# Altium project Temperature_sensor.PrjPcb
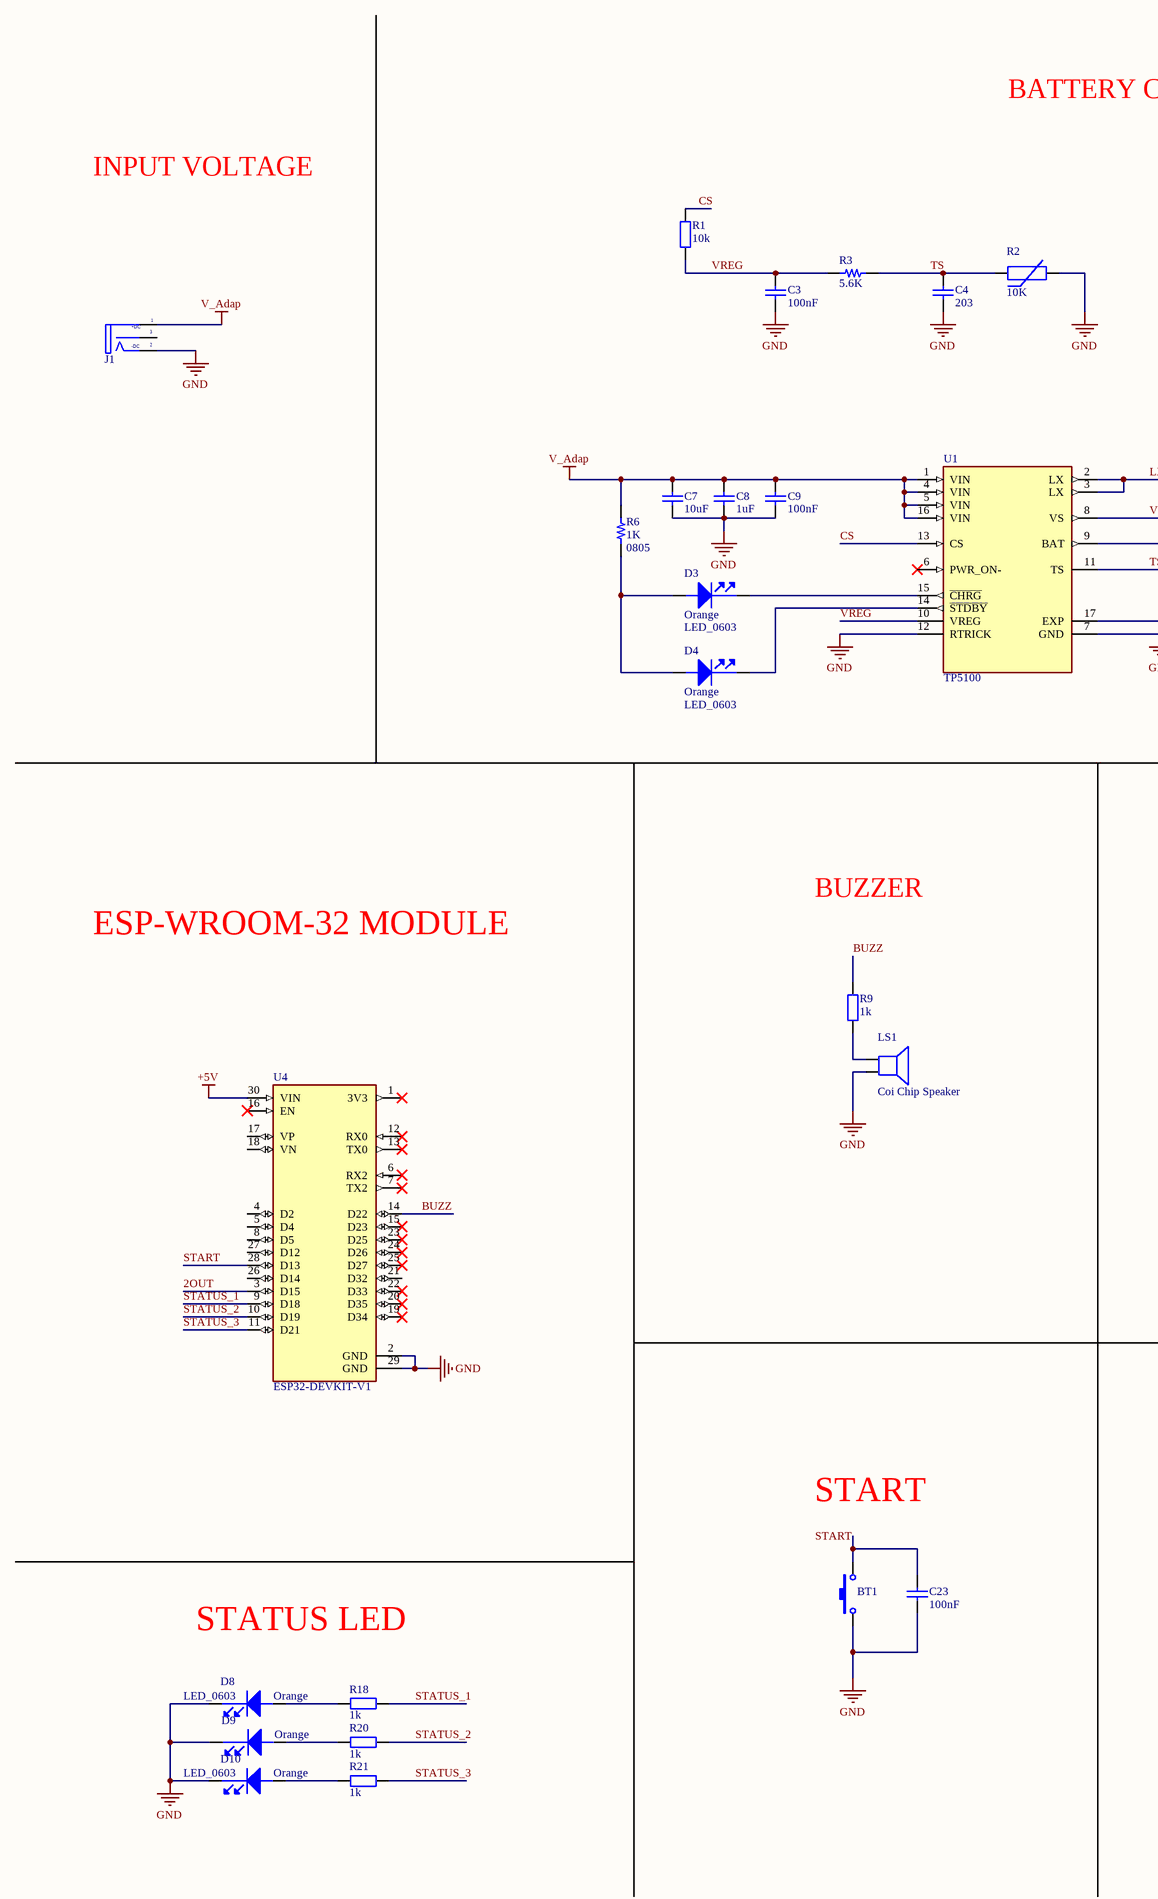
[diagram p0: Sheet1.SchDoc, left]
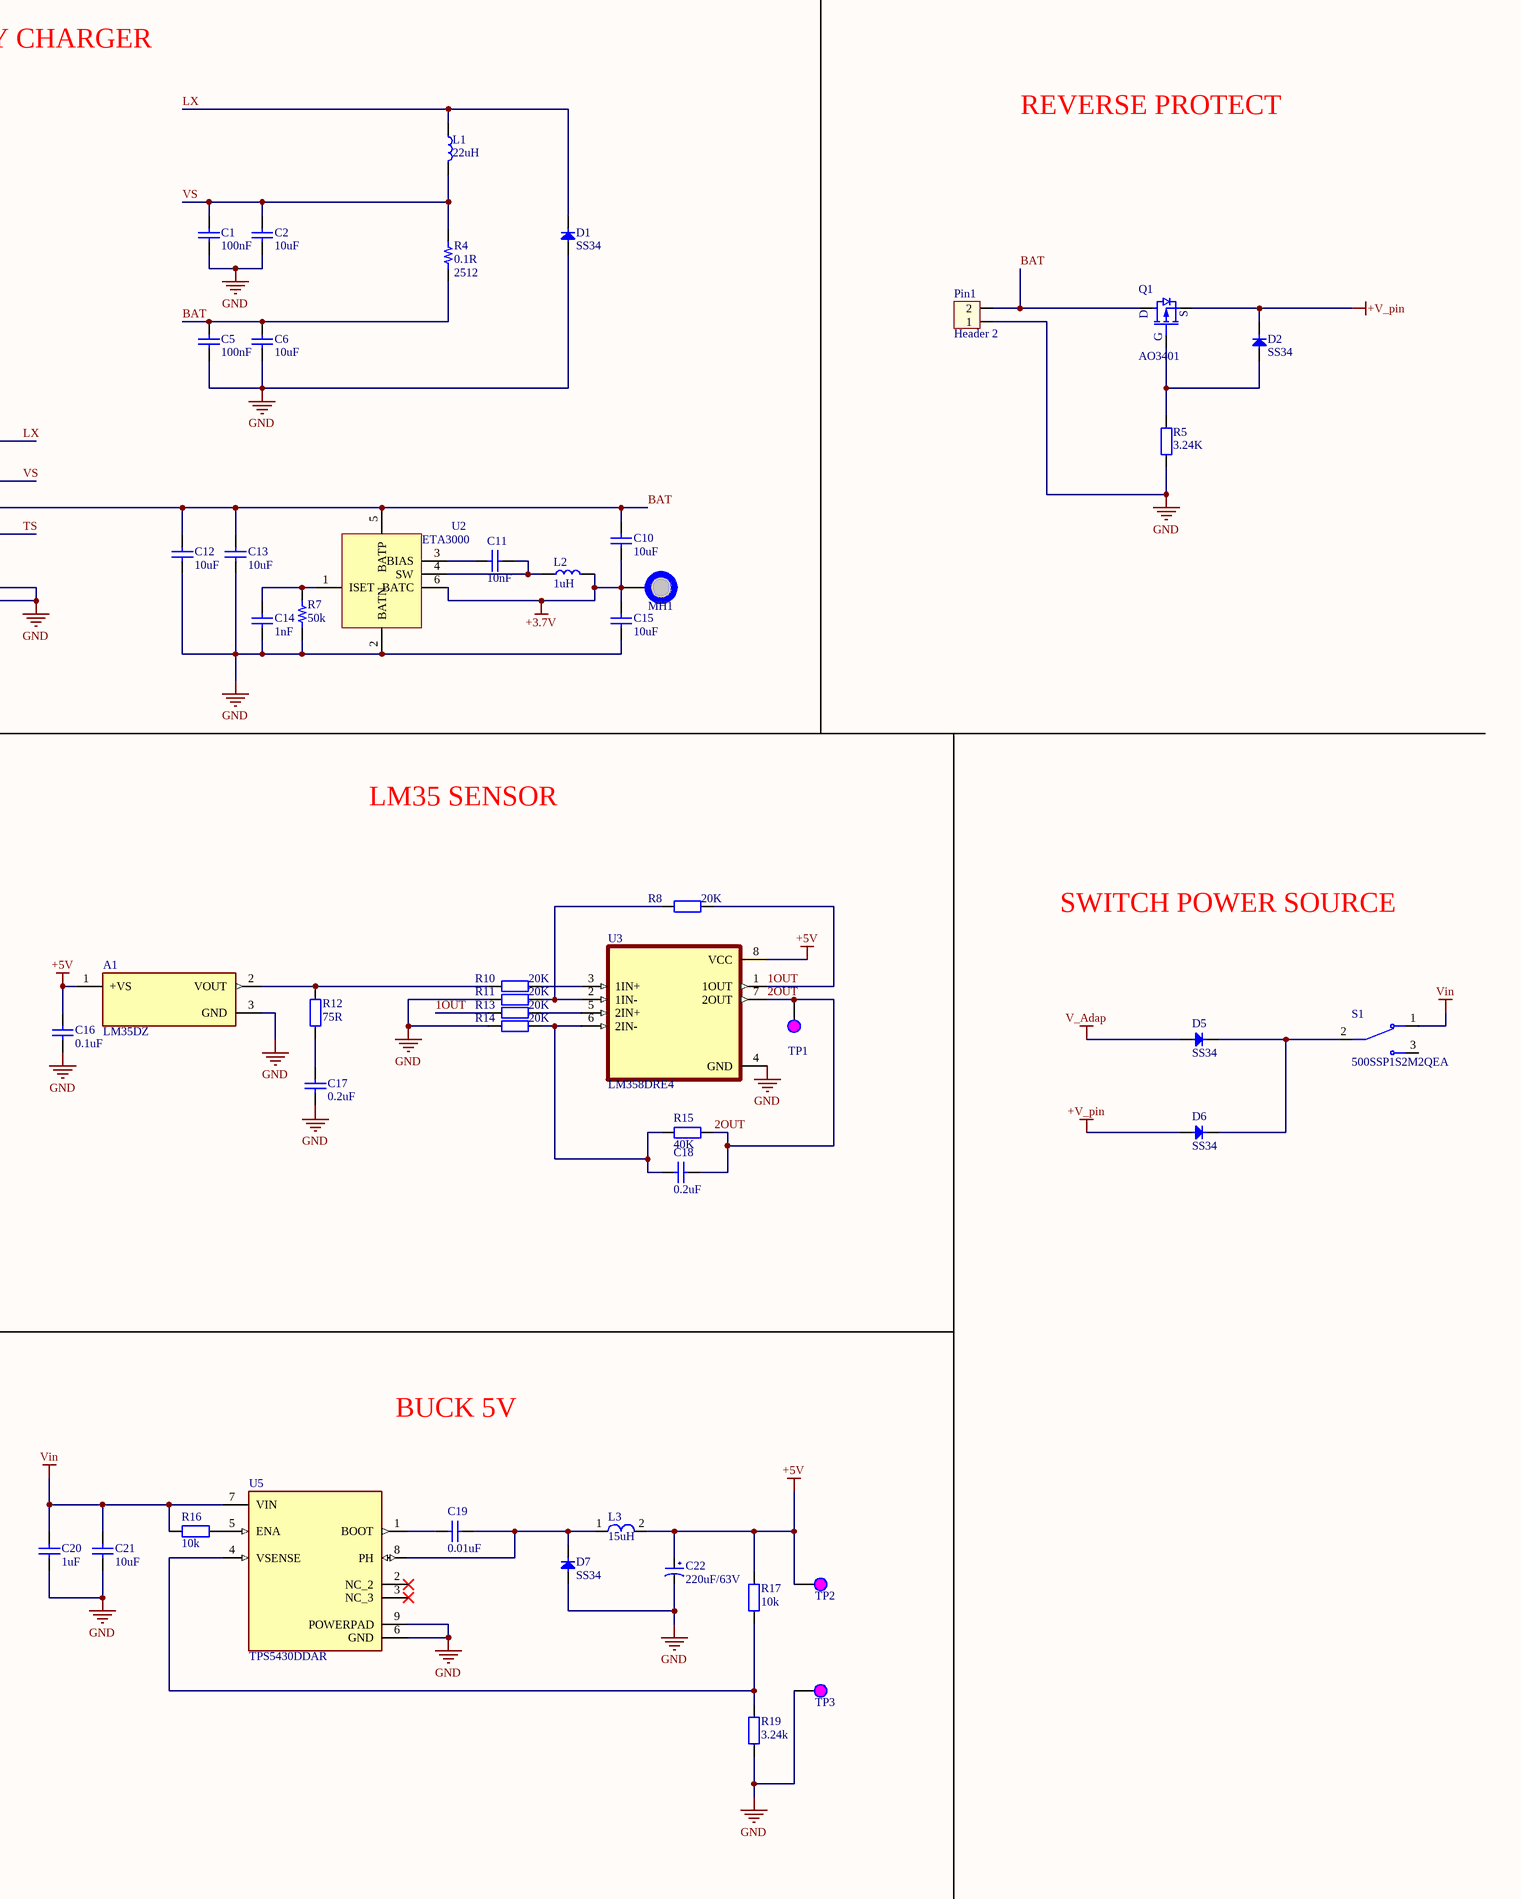
[diagram p1: Sheet1.SchDoc, right]
1 sheet, 73 parts. Net scope: global (net labels, ports and power ports of the same name join across sheets).
Board file: PCB1.PcbDoc

## Sheet Sheet1.SchDoc
size 513 x 381 mm; SheetNumber: 1; SheetTotal: 1

### Parts
A1  LM35DZ  [TO92127P521H735-3]
BT1  Nut Nhan 2 Chan SMD 3x6x2.5  [Nut Nhan 2 Chan SMD 3x6x2.5]  (value not drawn)
C1  100nF  [C0603C/1608MM]
C2  10uF  [C0603C/1608MM]
C3  100nF  [C0603C/1608MM]
C4  203  [tu gom]
C5  100nF  [C0603C/1608MM]
C6  10uF  [C0603C/1608MM]
C7  10uF  [C0603C/1608MM]
C8  1uF  [C0603C/1608MM]
C9  100nF  [C0603C/1608MM]
C10  10uF  [C0603C/1608MM]
C11  10nF  [C0603C/1608MM]
C12  10uF  [C0603C/1608MM]
C13  10uF  [C0603C/1608MM]
C14  1nF  [C0603C/1608MM]
C15  10uF  [C0603C/1608MM]
C16  0.1uF  [tu 0805]
C17  0.2uF  [tu 0805]
C18  0.2uF  [tu 0805]
C19  0.01uF  [tu 0805]
C20  1uF  [tu 0805]
C21  10uF  [tu 0805]
C22  220uF/63V  [CAP_ALUM_D070_S35_H115]
C23  100nF  [C0603C/1608MM]
D1  SS34  [SMA (DO-214AC)]
D2  SS34  [SMA (DO-214AC)]
D3  Orange  Package / Case: LED_0603  [LED_0603_0m65]
D4  Orange  Package / Case: LED_0603  [LED_0603_0m65]
D5  SS34  [SMA (DO-214AC)]
D6  SS34  [SMA (DO-214AC)]
D7  SS34  [SMA (DO-214AC)]
D8  Orange  Package / Case: LED_0603  [LED_0603_0m65]
D9  Orange  [LED_0603_0m65]
D10  Orange  Package / Case: LED_0603  [LED_0603_0m65]
J1  DCIN  [DC0_SMD]  (value not drawn)
L1  22uH  [IND 22uH]
L2  1uH  [IND 22uH]
L3  15uH  [L-SMD-M-7.3x4.5]
LS1  Coi Chip Speaker  [Coi Chip Speacker]
MH1  MH_3MMD_1.5MMH  [MH_3MMD_1.5MMH]  (value not drawn)
Pin1  Header 2  [HED2]
Q1  AO3401  [SOT 23]
R1  10k  [tro smd 0603]
R2  10K  [RESC-0603 (1608)]
R3  5.6K  [R0603B/1608MM]
R4  0.1R  Case/Package: 2512  [R2512B/6332MM]
R5  3.24K  [tro smd 0805]
R6  1K  Case/Package: 0805  [R0805B/2012MM]
R7  50k  [R0603B/1608MM]
R8  20K  [tro smd 0805]
R9  1k  [tro smd 0603]
R10  20K  [tro smd 0805]
R11  20K  [tro smd 0805]
R12  75R  [tro smd 0805]
R13  20K  [tro smd 0805]
R14  20K  [tro smd 0805]
R15  40K  [tro smd 0805]
R16  10k  [tro smd 0805]
R17  10k  [tro smd 0805]
R18  1k  [tro smd 0603]
R19  3.24k  [tro smd 0805]
R20  1k  [tro smd 0603]
R21  1k  [tro smd 0603]
S1  500SSP1S2M2QEA  [SW_500SSP1S2M2QEA]
TP1  Testpoint 2  [TP - 2]  (value not drawn)
TP2  Testpoint 2  [TP - 2]  (value not drawn)
TP3  Testpoint 2  [TP - 2]  (value not drawn)
U1  TP5100  [QFN65P400X400X90-17N]
U2  ETA3000  [ETA300]
U3  LM358DRE4  [SOIC127P599X175-8N]
U4  ESP32-DEVKIT-V1  [MODULE_ESP32_DEVKIT_V1]
U5  TPS5430DDAR  [CONV_TPS5430DDAR]

### Nets
+3.7V: C10.1 C15.2 L2.2 MH1.1 U2.6(BATC)
+5V: A1.1(+VS) C16.1 C22.1 L3.2 R17.2 TP2.1 U3.8(VCC) U4.30(VIN)
+V_pin: D2.2(K) D6.1(A) Q1.2(S)
GND: A1.3(GND) BT1.1 C1.1 C2.1 C3.1 C4.2 C5.1 C6.1 C7.1 C8.1 C9.1 C12.1 C13.1 C14.1 C15.1 C16.2 C17.2 C20.2 C21.2 C22.2 C23.1 D1.1(A) D7.1(A) D8.2(cathode) D9.2(cathode) D10.2(cathode) J1.2(TN) LS1.2 Pin1.1 R2.2 R5.1 R7.1 R11.2 R14.2 R19.1 TP3.1 U1.7(GND) U1.12(RTRICK) U1.17(EXP) U2.2(BATN) U3.4(GND) U4.2(GND) U4.29(GND) U5.6(GND) U5.9(POWERPAD)
V_Adap: C7.2 C8.2 C9.2 D5.1(A) J1.1(T) R6.2 U1.1(VIN) U1.4(VIN) U1.5(VIN) U1.16(VIN)
Vin: C20.1 C21.1 R16.2 S1.1(NC) U5.7(VIN)
1OUT: R8.1 R13.2 U3.1(1OUT)
2OUT: C18.2 R15.2 TP1.1 U3.7(2OUT) U4.3(D15)
BAT: C5.2 C6.2 C10.2 C12.2 C13.2 Pin1.2 Q1.3(D) R4.1 U1.9(BAT) U2.5(BATP)
BUZZ: R9.2 U4.14(D22)
CS: R1.2 U1.13(CS)
LX: D1.2(K) L1.1 U1.2(LX) U1.3(LX)
START: BT1.2 C23.2 U4.28(D13)
STATUS_1: R18.1 U4.9(D18)
STATUS_2: R20.1 U4.10(D19)
STATUS_3: R21.1 U4.11(D21)
TS: C4.1 R2.1 R3.1 U1.11(TS)
VREG: C3.2 R1.1 R3.2 U1.10(VREG)
VS: C1.2 C2.2 L1.2 R4.2 U1.8(VS)
NetA1_2: A1.2(VOUT) R10.1 R12.2
NetC11_1: C11.1 U2.3(BIAS)
NetC11_2: C11.2 L2.1 U2.4(SW)
NetC14_2: C14.2 R7.2 U2.1(ISET)
NetC17_1: C17.1 R12.1
NetC18_1: C18.1 R14.1 R15.1 U3.6(2IN-)
NetC19_1: C19.1 U5.1(BOOT)
NetC19_2: C19.2 D7.2(K) L3.1 U5.8(PH)
NetD2_1: D2.1(A) Q1.1(G) R5.2
NetD3_1: D3.1(ANODE) D4.1(ANODE) R6.1
NetD3_2: D3.2(cathode) U1.15(~{CHRG})
NetD4_2: D4.2(cathode) U1.14(~{STDBY})
NetD5_2: D5.2(K) D6.2(K) S1.2(COM)
NetD8_1: D8.1(ANODE) R18.2
NetD9_1: D9.1(ANODE) R20.2
NetD10_1: D10.1(ANODE) R21.2
NetLS1_1: LS1.1 R9.1
NetR8_2: R8.2 R11.1 U3.2(1IN-)
NetR10_2: R10.2 U3.3(1IN+)
NetR13_1: R13.1 U3.5(2IN+)
NetR16_1: R16.1 U5.5(ENA)
NetR17_1: R17.1 R19.2 U5.4(VSENSE)

Not connected (* = marked no-connect by the designer): J1 3(S); S1 3(NO); U1 6(PWR_ON-)*; U4 1(3V3)* 4(D2) 5(D4) 6(RX2)* 7(TX2)* 8(D5) 12(RX0)* 13(TX0)* 15(D23)* 16(EN)* 17(VP) 18(VN) 19(D34)* 20(D35)* 21(D32) 22(D33)* 23(D25)* 24(D26)* 25(D27)* 26(D14) 27(D12); U5 2(NC_2)* 3(NC_3)*

### Notes on the sheet
- BATTERY CHARGER
- INPUT VOLTAGE
- REVERSE PROTECT
- LM35 SENSOR
- BUZZER
- ESP-WROOM-32 MODULE
- SWITCH POWER SOURCE
- BUCK 5V
- START
- STATUS LED
- (in symbol DCIN) +DC; -DC

### Library data of the parts
A1 = LM35DZ/NOPB: Temperature Sensor Analog, Local 0Â°C ~ 100Â°C 10mV/Â°C TO-92-3; MF: Texas Instruments; Price: None; Availability: In Stock; Package: E-PKG AXIAL-LEADED-2 ON Semiconductor; MP: LM35DZ; Value: *; SnapEDA_Link: https://www.snapeda.com/parts/LM35DZ/Texas+Instruments/view-part/?ref=snap; Purchase-URL: https://pricing.snapeda.com/search/part/LM35DZ/?ref=eda; Check_prices: https://www.snapeda.com/parts/LM35DZ/Texas+Instruments/view-part/?ref=eda
BT1 = Nut Nhan 2 Chan SMD 3x6x2.5: Ma_Hang: MH001036; Ten: Nút Nhấn 2 Chân 3x6x2.5MM SMD
C1 C3 C5 C9 C23 = CAP CER 100nF 16V 5% X7R 0603: Cap Ceramic 0.1uF 16V X7R 5% SMD 0603 125C T/R; Manufacturer: Yageo; Manufacturer Part Number: CC0603JRX7R7BB104; Supplier 1: Digi-Key; Stock 1: 333951; Pricing 1: 1=0.1, 10=0.077, 50=0.042, 100=0.0343, 500=0.02448, 1000=0.01923 (USD); Mount: Surface Mount; Case/Package: 0603; Number of Pins: 2; Case Code (Metric): 1608; Case Code (Imperial): 0603; Min Operating Temperature: -55°C; Max Operating Temperature: 125°C; Capacitance: 100nF; Tolerance: 5%; Voltage Rating: 16V; Packaging: Tape and Reel; Dielectric: X7R; Voltage Rating (DC): 16V; Series: CC; Length: 1.6mm; Width: 0.031inch; Thickness: 0.035inch; Depth: 0.8mm; Radiation Hardening: No; Lead Free: Lead Free; Halogen Free: Halogen Free; RoHS Compliant: Yes; ComponentLink1URL: https://www.verical.com/server-webapp/html/getDatasheet?partID=403543&src-supplier=Verical; ComponentLink1Description: https://www.verical.com/server-webapp/html/getDatasheet?partID=403543&src-supplier=Verical; Supplier Part Number 1: 311-1776-1-ND
C2 C6-C8 C10 C12 C13 C15 = CAP CER 10uF 16V X7R 0603: CAP CER 0603 10uF 16V X7R 10%
C4 = Tu gom 203 50V: Cắm; Don_Vi: Con; So_Chan: 2; Ten_Linh_Kien: Tụ gốm 203 -20nF 50V; Ma_Hang: MH007482; Chung_Loai: Cắm; Kieu_Chan: *
C11 = CAP CER 10nF 16V X7R 0603: CAP CER 0603 10NF 16V X7R 10%; Manufacturer: KEMET; Manufacturer Part Number: C0603C103K4RECAUTO; Supplier 1: Digi-Key; Stock 1: 50866; Pricing 1: 1=0.15, 10=0.11, 50=0.0624, 100=0.0517, 500=0.03624, 1000=0.03 (USD); Mount: Surface Mount; Case/Package: 0603; Case Code (Imperial): 0603; Case Code (Metric): 1608; Min Operating Temperature: -55°C; Max Operating Temperature: 125°C; Packaging: Tape and Reel; Capacitance: 10nF; Tolerance: 10%; Voltage Rating: 16V; Ratings: AEC-Q200; RoHS Compliant: Yes; ComponentLink1URL: https://api.kemet.com/component-edge/download/datasheet/C0603C103K4RECAUTO.pdf?src-supplier=Digi-Key; ComponentLink1Description: https://api.kemet.com/component-edge/download/datasheet/C0603C103K4RECAUTO.pdf?src-supplier=Digi-Key; Supplier Part Number 1: 399-17880-1-ND
C14 = CAP CER 1nF 16V 5% X7R 0603: 1000 pF ±5% 16V Ceramic Capacitor X7R 0603 (1608 Metric); Manufacturer: KEMET; Manufacturer Part Number: C0603X102J4RECAUTO; Supplier 1: Digi-Key; Stock 1: 2638; Pricing 1: 1=0.22, 10=0.147, 50=0.0882, 100=0.0744, 500=0.0509, 1000=0.04503 (USD); Mount: Surface Mount; Case/Package: 0603; Case Code (Imperial): 0603; Case Code (Metric): 1608; Min Operating Temperature: -55°C; Max Operating Temperature: 125°C; Features: Soft Termination; Packaging: Tape and Reel; Capacitance: 1nF; Tolerance: 5%; Voltage Rating: 16V; Ratings: AEC-Q200; RoHS Compliant: Yes; ComponentLink1URL: http://www.farnell.com/datasheets/2743686.pdf?src-supplier=Newark; ComponentLink1Description: http://www.farnell.com/datasheets/2743686.pdf?src-supplier=Newark; ComponentLink2URL: http://www.farnell.com/datasheets/2743686.pdf?src-supplier=Farnell; ComponentLink2Description: http://www.farnell.com/datasheets/2743686.pdf?src-supplier=Farnell; ComponentLink3URL: https://api.kemet.com/component-edge/download/datasheet/C0603X102J4RECAUTO.pdf?src-supplier=Digi-Key; ComponentLink3Description: https://api.kemet.com/component-edge/download/datasheet/C0603X102J4RECAUTO.pdf?src-supplier=Digi-Key; Supplier Part Number 1: 399-17840-1-ND
C16-C21 = Tu 0805 10pF 50V 10%: Dán; Don_Vi: Con; So_Chan: 2; Ten_Linh_Kien: Tụ 0805 10P 10% 50V; Ma_Hang: MH004554; Chung_Loai: Dán; Kieu_Chan: *
C22 = CAP ALUM 47UF 20% 63V RADIAL: Cap Aluminum 47uF 63V 20% (8 X 11.5mm) Radial 3.5mm 405mA 3000 hr 105C Ammo Pack; Manufacturer: Nichicon; Manufacturer Part Number: UPW1J470MPD1TD; Dielectric Material: Aluminium; ESR (Equivalent Series Resistance): 684mR; Impedance: 342mR; Life (Hours): 3000Hour; Supplier 1: Digi-Key; Stock 1: 26935; Pricing 1: 1=0.45, 10=0.321, 50=0.2424, 100=0.2111, 500=0.15634 (USD); Mount: Through Hole; Case/Package: Radial; Min Operating Temperature: -55°C; Max Operating Temperature: 105°C; Capacitance: 47uF; Tolerance: 20%; Ripple Current: 405mA; Voltage Rating: 63V; Package Quantity: 1000; Packaging: Tape and Reel; Termination: Radial; Voltage Rating (DC): 63V; Series: UPW; Diameter: 8mm; Height: 11.5mm; Lead Pitch: 3.5mm; Height - Seated (Max): 0.512inch; Radiation Hardening: No; Reach SVHC Compliant: Yes; Lead Free: Lead Free; RoHS Compliant: Yes; ComponentLink1URL: https://datasheet.ciiva.com/7907/e-pw-7907438.pdf?src-supplier=Element14; ComponentLink1Description: https://datasheet.ciiva.com/7907/e-pw-7907438.pdf?src-supplier=Element14; ComponentLink2URL: https://datasheet.ciiva.com/46391/1909381-46391130.pdf?src-supplier=Element14; ComponentLink2Description: https://datasheet.ciiva.com/46391/1909381-46391130.pdf?src-supplier=Element14; ComponentLink3URL: https://datasheet.ciiva.com/29546/e-pw-29546670.pdf?src-supplier=Digi-Key; ComponentLink3Description: https://datasheet.ciiva.com/29546/e-pw-29546670.pdf?src-supplier=Digi-Key; ComponentLink4URL: https://datasheet.ciiva.com/29546/e-pw-29546669.pdf?src-supplier=Digi-Key; ComponentLink4Description: https://datasheet.ciiva.com/29546/e-pw-29546669.pdf?src-supplier=Digi-Key; ComponentLink5URL: https://datasheet.ciiva.com/16502/e-pw-16502651.pdf?src-supplier=Future+Electronics; ComponentLink5Description: https://datasheet.ciiva.com/16502/e-pw-16502651.pdf?src-supplier=Future+Electronics; Supplier Part Number 1: 493-11607-1-ND
D1 D2 D5-D7 = DIODE SCHOTTKY 40V 3A SMC: SS Series 500 mV 3 A 40 V Max Reverse Voltage Schottky Rectifier - DO-214AB; Manufacturer: Taiwan Semiconductor; Element Configuration: Single; Forward Current: 3A; Max Repetitive Reverse Voltage (Vrrm): 40V; Polarity: Standard; Max Reverse Current: 500uA; Max Surge Current: 100A; Supplier 1: Digi-Key; Manufacturer Part Number: SS34; Stock 1: 0; Pricing 1: 3000=0.20021, 6000=0.18729, 15000=0.1863 (USD); Mount: Surface Mount; Case/Package: SMC; Number of Pins: 2; Min Operating Temperature: -55°C; Max Operating Temperature: 125°C; Packaging: Tape and Reel; Voltage Rating (DC): 40V; Current Rating: 3A; Output Current: 3A; Package Quantity: 3000; Max Reverse Leakage Current: 500uA; Peak Non-Repetitive Surge Current: 100A; Lead Free: Lead Free; RoHS Compliant: Yes; Reach SVHC Compliant: Yes; ComponentLink1URL: http://datasheet.octopart.com/SS34-Taiwan-Semiconductor-datasheet-34355611.pdf?src-supplier=Digi-Key; ComponentLink1Description: http://datasheet.octopart.com/SS34-Taiwan-Semiconductor-datasheet-34355611.pdf?src-supplier=Digi-Key; ComponentLink2URL: https://datasheet.octopart.com/SS34-Taiwan-Semiconductor-datasheet-13721713.pdf?src-supplier=Farnell; ComponentLink2Description: https://datasheet.octopart.com/SS34-Taiwan-Semiconductor-datasheet-13721713.pdf?src-supplier=Farnell; ComponentLink3URL: https://datasheet.octopart.com/SS34-Taiwan-Semiconductor-datasheet-68472394.pdf?src-supplier=Element14; ComponentLink3Description: https://datasheet.octopart.com/SS34-Taiwan-Semiconductor-datasheet-68472394.pdf?src-supplier=Element14; ComponentLink4URL: https://datasheet.octopart.com/SS34-Taiwan-Semiconductor-datasheet-8823.pdf?src-supplier=Mouser; ComponentLink4Description: https://datasheet.octopart.com/SS34-Taiwan-Semiconductor-datasheet-8823.pdf?src-supplier=Mouser; ComponentLink5URL: http://datasheet.octopart.com/SS34-Taiwan-Semiconductor-datasheet-34355611.pdf?src-supplier=Avnet; ComponentLink5Description: http://datasheet.octopart.com/SS34-Taiwan-Semiconductor-datasheet-34355611.pdf?src-supplier=Avnet; ComponentLink6URL: http://datasheet.octopart.com/SS34-Taiwan-Semiconductor-datasheet-34355611.pdf?src-supplier=Onlinecomponents.com; ComponentLink6Description: http://datasheet.octopart.com/SS34-Taiwan-Semiconductor-datasheet-34355611.pdf?src-supplier=Onlinecomponents.com; Supplier Part Number 1: 1801-SS34TR-ND
D3 D4 D8-D10 = LED ORANGE 606NM 0603: LED SMARTLED ORANGE 606NM 0603; Manufacturer: OSRAM Opto Semiconductors Inc; Manufacturer Part Number: LO L29K-H2K1-24-Z; Millicandela Rating: 6.3mcd; Voltage - Forward (Vf) Typ: 1.8V; Current - Test: 2mA; Wavelength - Peak: 610nm; Viewing Angle: 160°; Lens Type: Diffused; Lens Style/Size: Rectangle with Flat Top, 1.3mm x 0.8mm; Luminous Flux @ Current - Test: 25 mlm; By: Hieu.Nguyen_20191030; Supplier 1: Digi-Key; Supplier Part Number 1: 475-2740-1-ND; RoHS: RoHS Compliant; Category: Optoelectronics; Stock 1: 15900; Pricing 1: 1=0.17, 10=0.141, 100=0.1127, 250=0.0986, 500=0.09016 (USD); Color: Orange; Wavelength - Dominant: 606nm; Size / Dimension: 1.70mm L x 0.80mm W; Height: 0.65mm; Mounting Type: Surface Mount; Packaging: Cut Tape (CT); ComponentLink1URL: http://catalog.osram-os.com/catalogue/catalogue.do;jsessionid=302CF83AF637AE24E40AEB0ADA267EDD?act=downloadFile&favOid=020000010003f9de000100b6; ComponentLink1Description: http://catalog.osram-os.com/catalogue/catalogue.do;jsessionid=302CF83AF637AE24E40AEB0ADA267EDD?act=downloadFile&favOid=020000010003f9de000100b6
J1 = DCIN: CONN POWER JACK 2.1X5.5MM SMD
L1 L2 = IND FIXED 22UH 3A 50 MOHM SMD CD104-220 10x10x4mm: Inductor Power Shielded Wirewound 22uH 20% 100KHz Ferrite 3A 0.05Ohm DCR Automotive T/R; Manufacturer: Wurth Electronics; Manufacturer Part Number: 7447714220; Saturation Current: 3.6A; DC Resistance (DCR): 50mR; Self Resonant Frequency: 14.5MHz; Supplier 1: Digi-Key; Stock 1: 9408; Pricing 1: 1=2.26, 10=2.172, 50=1.961, 100=1.759, 250=1.61 (USD); Mount: Surface Mount; Case/Package: Nonstandard; Core Material: Ferrite; Min Operating Temperature: -40°C; Max Operating Temperature: 125°C; Package Quantity: 1; Current Rating: 3A; Tolerance: 20%; Shielding: Shielded; Packaging: Tape and Reel; Inductance Tolerance: 20%; Inductance: 22uH; Resistor Type: Wirewound; Test Frequency: 100kHz; Max DC Current: 3A; Termination: SMD/SMT; RMS Current (Irms): 3A; Series: WE-PD; Resistance: 50mR; Series Resistance: 50mR; Length: 10mm; Width: 10mm; Height: 5mm; Height - Seated (Max): 0.197inch; Depth: 10mm; Ratings: AEC-Q200; RoHS Compliant: Yes; ComponentLink1URL: https://datasheet.ciiva.com/13320/7447714220-70113-13320863.pdf?src-supplier=Mouser; ComponentLink1Description: https://datasheet.ciiva.com/13320/7447714220-70113-13320863.pdf?src-supplier=Mouser; ComponentLink2URL: https://datasheet.ciiva.com/1058/7447714220-1058608.pdf?src-supplier=Digi-Key; ComponentLink2Description: https://datasheet.ciiva.com/1058/7447714220-1058608.pdf?src-supplier=Digi-Key; ComponentLink3URL: https://datasheet.ciiva.com/30489/0900766b81281c0b-30489748.pdf?src-supplier=Rs; ComponentLink3Description: https://datasheet.ciiva.com/30489/0900766b81281c0b-30489748.pdf?src-supplier=Rs; ComponentLink4URL: https://datasheet.ciiva.com/7691/1736273-7691674.pdf?src-supplier=Element14; ComponentLink4Description: https://datasheet.ciiva.com/7691/1736273-7691674.pdf?src-supplier=Element14; ComponentLink5URL: https://datasheet.ciiva.com/1058/7447714220-1058609.pdf?src-supplier=Digi-Key; ComponentLink5Description: https://datasheet.ciiva.com/1058/7447714220-1058609.pdf?src-supplier=Digi-Key; ComponentLink6URL: https://datasheet.ciiva.com/48691/001087798-da-01-ml-we-pd-smd-speicherdrossel-74477142-de-en-48691509.pdf?src-supplier=Conrad; ComponentLink6Description: https://datasheet.ciiva.com/48691/001087798-da-01-ml-we-pd-smd-speicherdrossel-74477142-de-en-48691509.pdf?src-supplier=Conrad; Supplier Part Number 1: 732-2992-1-ND
L3 = L-SMD-1: partNo: 78477010; Manufacturer: Wurth Elektronik; Inductance: 1.0 μH; ComponentLink1Description: Manufacturer; ComponentLink1URL: http://www.we-online.de; Created by: Baojun Chen; Created Date: Nov.2015; ComponentLink2Description: Datasheet; ComponentLink2URL: http://katalog.we-online.de/pbs/datasheet/78477010.pdf
LS1 = Coi Chip Speaker: Còi chip
MH1 = MH_3MMD_1.5MMH: Mounting Hole 3mm Diameter, 1.5mm Hole
Pin1 = Hed2: Header 2 (Green); Value: Header 2
Q1 = MOSFET P-CH 30V 4A SOT23-3: Transistor P-Channel MOSFET; 30V; 4, 2A; 1, 4W; 85 mOhm; -55°C ~ 150°C; ;; Manufacturer: Alpha & Omega Semiconductor; Manufacturer Part Number: AO3401A; Rds On Max: 44mR; Input Capacitance: 1.2nF; Continuous Drain Current (ID): 4A; Max Power Dissipation: 1.4W; Number of Elements: 1; Supplier 1: Digi-Key; Stock 1: 1131740; Pricing 1: 1=0.44, 10=0.333, 100=0.2073, 500=0.1418, 1000=0.10908 (USD); Mount: Surface Mount; Case/Package: TO-236-3; Number of Pins: 3; Min Operating Temperature: -55°C; Max Operating Temperature: 150°C; Packaging: Cut Tape; Drain to Source Voltage (Vdss): 30V; Series: -; Power Dissipation: 1.4W; Radiation Hardening: No; RoHS Compliant: Yes; Lead Free: Lead Free; ComponentLink1URL: https://datasheet.ciiva.com/940/ao3401a-940720.pdf?src-supplier=Digi-Key; ComponentLink1Description: https://datasheet.ciiva.com/940/ao3401a-940720.pdf?src-supplier=Digi-Key; ComponentLink2URL: https://datasheet.ciiva.com/26927/getdatasheetpartid-79048-26927888.pdf?src-supplier=Verical; ComponentLink2Description: https://datasheet.ciiva.com/26927/getdatasheetpartid-79048-26927888.pdf?src-supplier=Verical; Supplier Part Number 1: 785-1001-1-ND
R1 = Tro 0603 5% 10k: Dán; Don_Vi: Con; So_Chan: 2; Ten_Linh_Kien: Trở 0603 5% 10k; Ma_Hang: MH006316; Chung_Loai: Dán; Kieu_Chan: *
R2 = NTCG163JF103FT1: THERMISTOR 10K OHM 1% 0603; CompanyID: VT-01145; Solder: SMT; MPN: NTCG163JF103FT1; Value: 10K; Category: RESISTOR
R3 R7 = RES SMD 10K OHM 5% 1/10W 0603: Surface Mount Thick Film Resistor, RC Series, 10 kohm, 100 mW, - 5%, 50 V, 0603 [1608 Metric]; Manufacturer: Yageo; Manufacturer Part Number: RC0603JR-0710KL; Resistance: 10kR; Temperature Coefficient: 100ppm/°C; Voltage Rating (DC): 50V; Power Rating: 100mW; Supplier 1: Digi-Key; Stock 1: 10996894; Pricing 1: 1=0.1, 10=0.02, 100=0.008, 1000=0.0036, 2500=0.00312 (USD); Case/Package: 0603; Number of Pins: 2; Contact Plating: Tin,Matte; Min Operating Temperature: -55°C; Max Operating Temperature: 155°C; Tolerance: 5%; Resistor Type: Thick Film; Packaging: Tape and Reel; Voltage Rating: 50V; Termination: SMD/SMT; Features: Moisture Resistant; Max Power Dissipation: 100mW; Number of Terminations: 2; Length: 0.063inch; Width: 0.031inch; Depth: 0.8mm; Height - Seated (Max): 0.022inch; Radiation Hardening: No; REACH SVHC: Unknown; Lead Free: Lead Free; Military Standard: Not; RoHS Compliant: Yes; ComponentLink1URL: http://www.yageo.com/documents/recent/PYu-RC_Group_51_RoHS_L_10.pdf?src-supplier=Digi-Key; ComponentLink1Description: http://www.yageo.com/documents/recent/PYu-RC_Group_51_RoHS_L_10.pdf?src-supplier=Digi-Key; Supplier Part Number 1: 311-10KGRCT-ND; Case Code (Metric): 1608; Case Code (Imperial): 0603
R4 = RES SMD 0.2 OHM 5% 1W 2512: Surface Mount Thick Film Resistor, RC Series, 10 kohm, 1W, - 5%, 50 V, 2512; Manufacturer: Yageo; Manufacturer Part Number: RC0603JR-0710KL; Resistance: 10kR; Temperature Coefficient: 100ppm/°C; Voltage Rating (DC): 50V; Power Rating: 100mW; Supplier 1: Digi-Key; Stock 1: 10996894; Pricing 1: 1=0.1, 10=0.02, 100=0.008, 1000=0.0036, 2500=0.00312 (USD); Number of Pins: 2; Contact Plating: Tin,Matte; Min Operating Temperature: -55°C; Max Operating Temperature: 155°C; Tolerance: 5%; Resistor Type: Thick Film; Packaging: Tape and Reel; Voltage Rating: 50V; Termination: SMD/SMT; Features: Moisture Resistant; Max Power Dissipation: 1W; Number of Terminations: 2; Length: 0.063inch; Width: 0.031inch; Depth: 0.8mm; Height - Seated (Max): 0.022inch; Radiation Hardening: No; REACH SVHC: Unknown; Lead Free: Lead Free; Military Standard: Not; RoHS Compliant: Yes; ComponentLink1URL: http://www.yageo.com/documents/recent/PYu-RC_Group_51_RoHS_L_10.pdf?src-supplier=Digi-Key; ComponentLink1Description: http://www.yageo.com/documents/recent/PYu-RC_Group_51_RoHS_L_10.pdf?src-supplier=Digi-Key; Supplier Part Number 1: 311-10KGRCT-ND; Case Code (Metric): 6332; Case Code (Imperial): 6332
R5 = Tro 0805 5% 560R: Dán; Don_Vi: Con; So_Chan: 2; Ten_Linh_Kien: Trở 0805 5% 560R; Ma_Hang: MH005261; Chung_Loai: Dán; Kieu_Chan: *
R6 = RES SMD 1.8M OHM 5% 1/8W 0805: Res Thick Film 0805 1.8M Ohm 5% 1/8W ±100ppm/°C Molded SMD SMD Paper T/R; Manufacturer: Yageo; Manufacturer Part Number: RC0805JR-071M8L; Resistance: 1.8MR; Power Rating: 125mW; Voltage Rating: 150V; Supplier 1: Digi-Key; Stock 1: 11875; Pricing 1: 1=0.1, 10=0.036, 100=0.0145, 1000=0.00652, 2500=0.00566 (USD); Contact Plating: Tin,Matte; Case Code (Imperial): 0805; Case Code (Metric): 2012; Size Code: 0805; Min Operating Temperature: -55°C; Max Operating Temperature: 155°C; Tolerance: 5%; Resistor Type: Thick Film; Temperature Coefficient: 100ppm/°C; Packaging: Tape and Reel; Package Quantity: 1; Termination: SMD/SMT; Number of Terminations: 2; Max Power Dissipation: 125mW; Voltage Rating (DC): 150V; Features: Moisture Resistant; Series: RC; Construction: Rectangular; Length: 2mm; Width: 1.25mm; Height: 0.5mm; Depth: 1.25mm; Radiation Hardening: No; Military Standard: Not; Lead Free: Lead Free; RoHS Compliant: Yes; ComponentLink1URL: http://www.yageo.com/documents/recent/PYu-RC_Group_51_RoHS_L_9.pdf?src-supplier=Digi-Key; ComponentLink1Description: http://www.yageo.com/documents/recent/PYu-RC_Group_51_RoHS_L_9.pdf?src-supplier=Digi-Key; ComponentLink2URL: https://www.yageo.com/upload/media/product/productsearch/datasheet/rchip/PYu-RC_Group_51_RoHS_L_10.pdf?src-supplier=Digi-Key; ComponentLink2Description: https://www.yageo.com/upload/media/product/productsearch/datasheet/rchip/PYu-RC_Group_51_RoHS_L_10.pdf?src-supplier=Digi-Key; Supplier Part Number 1: 311-1.8MARDKR-ND
R8 R10-R15 R19 = Tro 0805 5% 3.3k: Dán; Don_Vi: Con; So_Chan: 2; Ten_Linh_Kien: Trở 0805 5% 3.3k; Ma_Hang: MH005305; Chung_Loai: Dán; Kieu_Chan: *
R9 R18 R20 R21 = Tro 0603 1% 1k: Dán; So_Chan: 2; Don_Vi: Con; Ten_Linh_Kien: Trở 0603 1% 1k; Ma_Hang: MH006334; Chung_Loai: Dán; Kieu_Chan: *
R16 R17 = Tro 0805 5% 10k: Dán; Don_Vi: Con; So_Chan: 2; Ten_Linh_Kien: Trở 0805 5% 10k; Ma_Hang: MH005239; Chung_Loai: Dán; Kieu_Chan: *
S1 = 500SSP1S2M2QEA: Slide Switch SPDT Through Hole; Package: None; Value: *; Price: None; MP: 500SSP1S2M2QEA; Availability: Unavailable
U1 = TP5100: 2A-switch buck 8.4V / 4.2V rechargeable lithium battery; MF: NanJing Top Power ASIC Corp.; Availability: Not in stock; MP: TP5100; Price: None; Value: *; SnapEDA_Link: https://www.snapeda.com/parts/TP5100/NanJing+Top+Power+ASIC+Corp./view-part/?ref=snap; Check_prices: https://www.snapeda.com/parts/TP5100/NanJing+Top+Power+ASIC+Corp./view-part/?ref=eda; Package: Package
U3 = LM358DRE4: Dual standard operational amplifier 8-SOIC 0 to 70; MF: Texas Instruments; Availability: Good; SnapEDA_Link: https://www.snapeda.com/parts/LM358DRE4/Texas%20Instruments/view-part/544216/?ref=snap; Price: None; MP: LM358DRE4; Value: *; Package: SOIC-8 Texas Instruments; Check_prices: https://www.snapeda.com/parts/LM358DRE4/Texas%20Instruments/view-part/544216/?ref=eda; Purchase-URL: https://pricing.snapeda.com/search/part/LM358DRE4/?ref=eda
U4 = ESP32-DEVKIT-V1: Dual core, Wi-Fi: 2.4 GHz up to 150 Mbits/s,BLE (Bluetooth Low Energy) and legacy Bluetooth, 32 bits, Up to 240 MHz; MF: Do it; Price: None; Availability: Not in stock; Package: None; MP: ESP32-DEVKIT-V1; Value: *; SnapEDA_Link: https://www.snapeda.com/parts/ESP32-DEVKIT-V1/Do+it/view-part/?ref=snap; Check_prices: https://www.snapeda.com/parts/ESP32-DEVKIT-V1/Do+it/view-part/?ref=eda
U5 = TPS5430DDAR: 5.5V to 36V Input, 3A, 500kHz Step-Down Converter; MF: Texas Instruments; Package: HSOIC-8 Texas Instruments; Check_prices: https://www.snapeda.com/parts/TPS5430DDAR/Texas+Instruments/view-part/?ref=eda; Value: *; Purchase-URL: https://pricing.snapeda.com/search/part/TPS5430DDAR/?ref=eda; Availability: In Stock; SnapEDA_Link: https://www.snapeda.com/parts/TPS5430DDAR/Texas+Instruments/view-part/?ref=snap; MP: TPS5430DDAR; Price: None